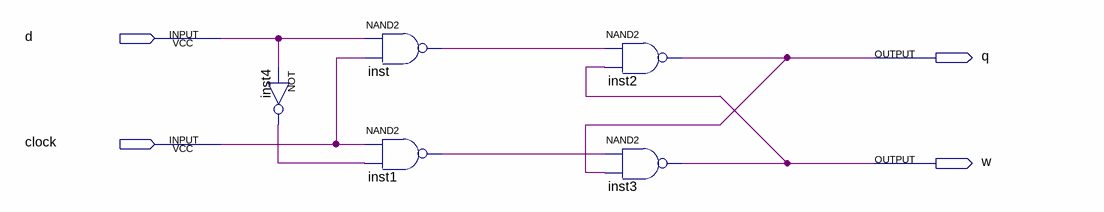
[diagram p0: schematic sheet]
// Quartus schematic dff1.bdf as structural Verilog: 5 symbols, 4 pins
module dff1 (
  input  d,
  input  clock,
  output q,
  output w
);

  wire inst1_out, inst4_out, inst_out;

  not inst4 (inst4_out, d);
  nand inst (inst_out, d, clock);
  nand inst1 (inst1_out, clock, inst4_out);
  nand inst2 (q, inst_out, w);
  nand inst3 (w, inst1_out, q);
endmodule
